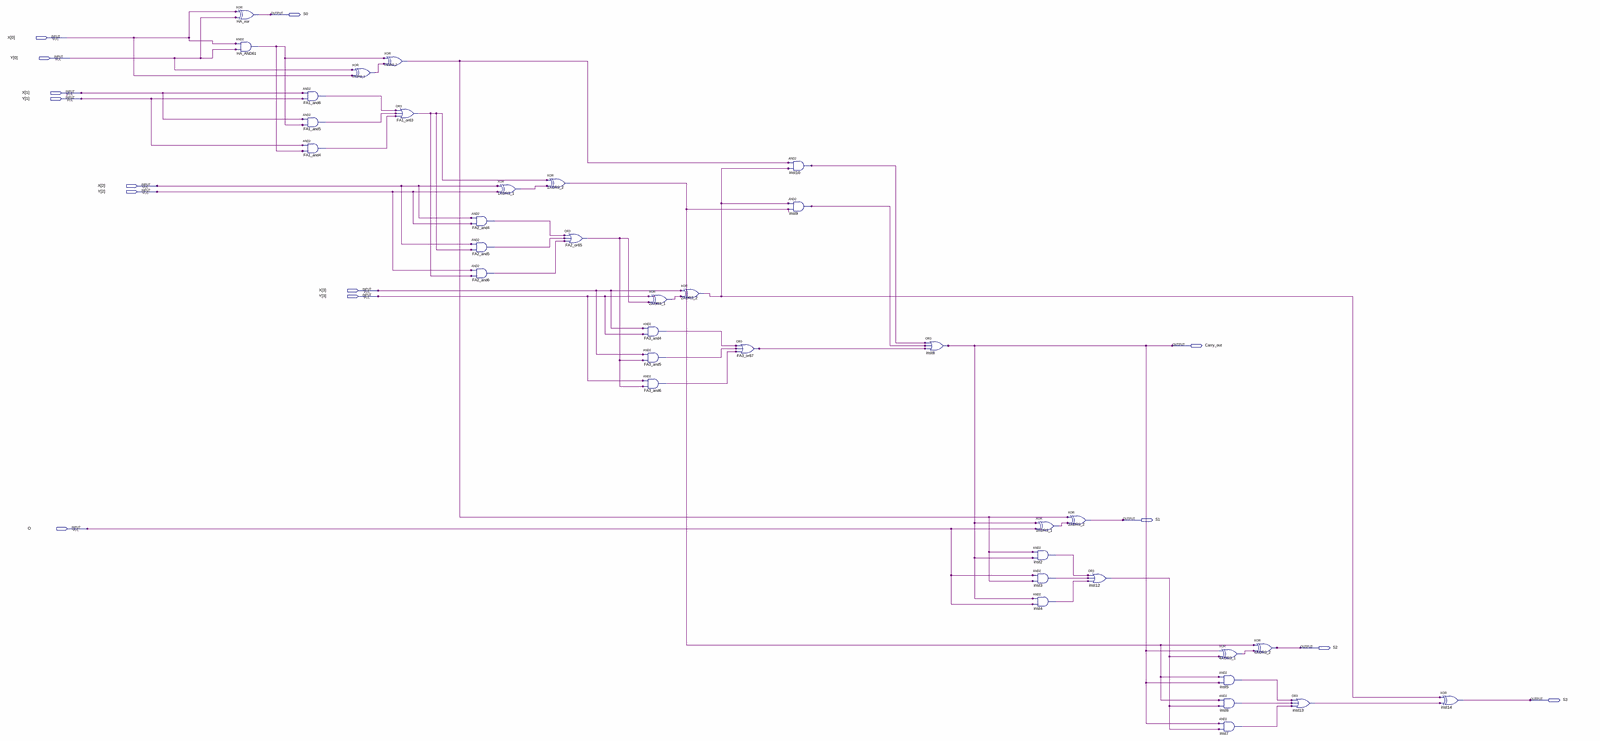
[diagram p0: schematic sheet, whole]
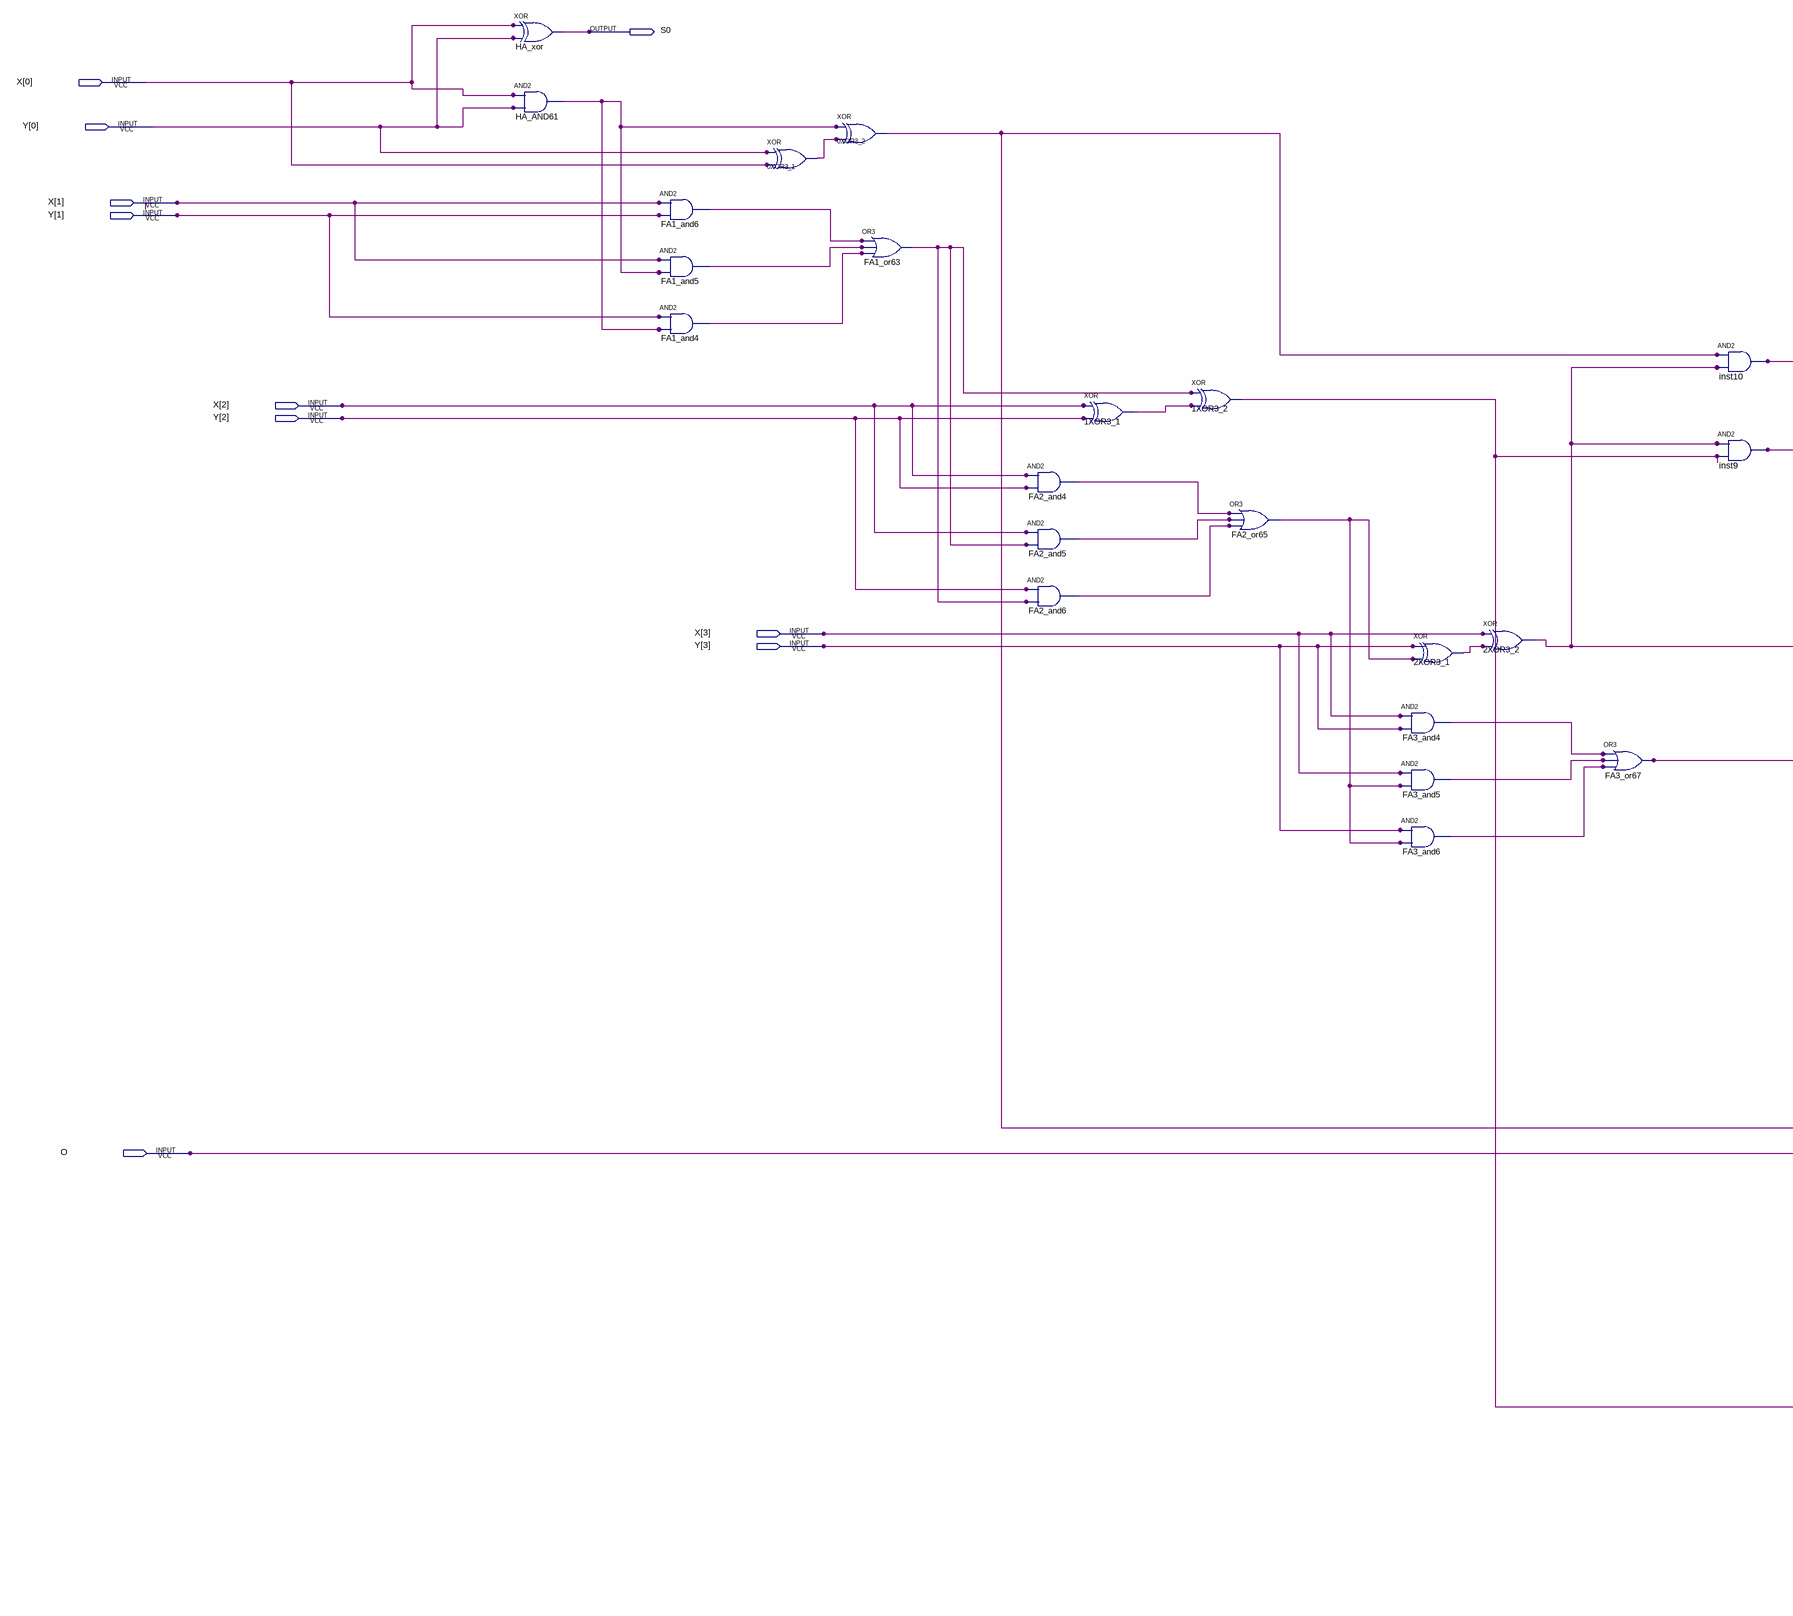
[diagram p1: schematic sheet, left part]
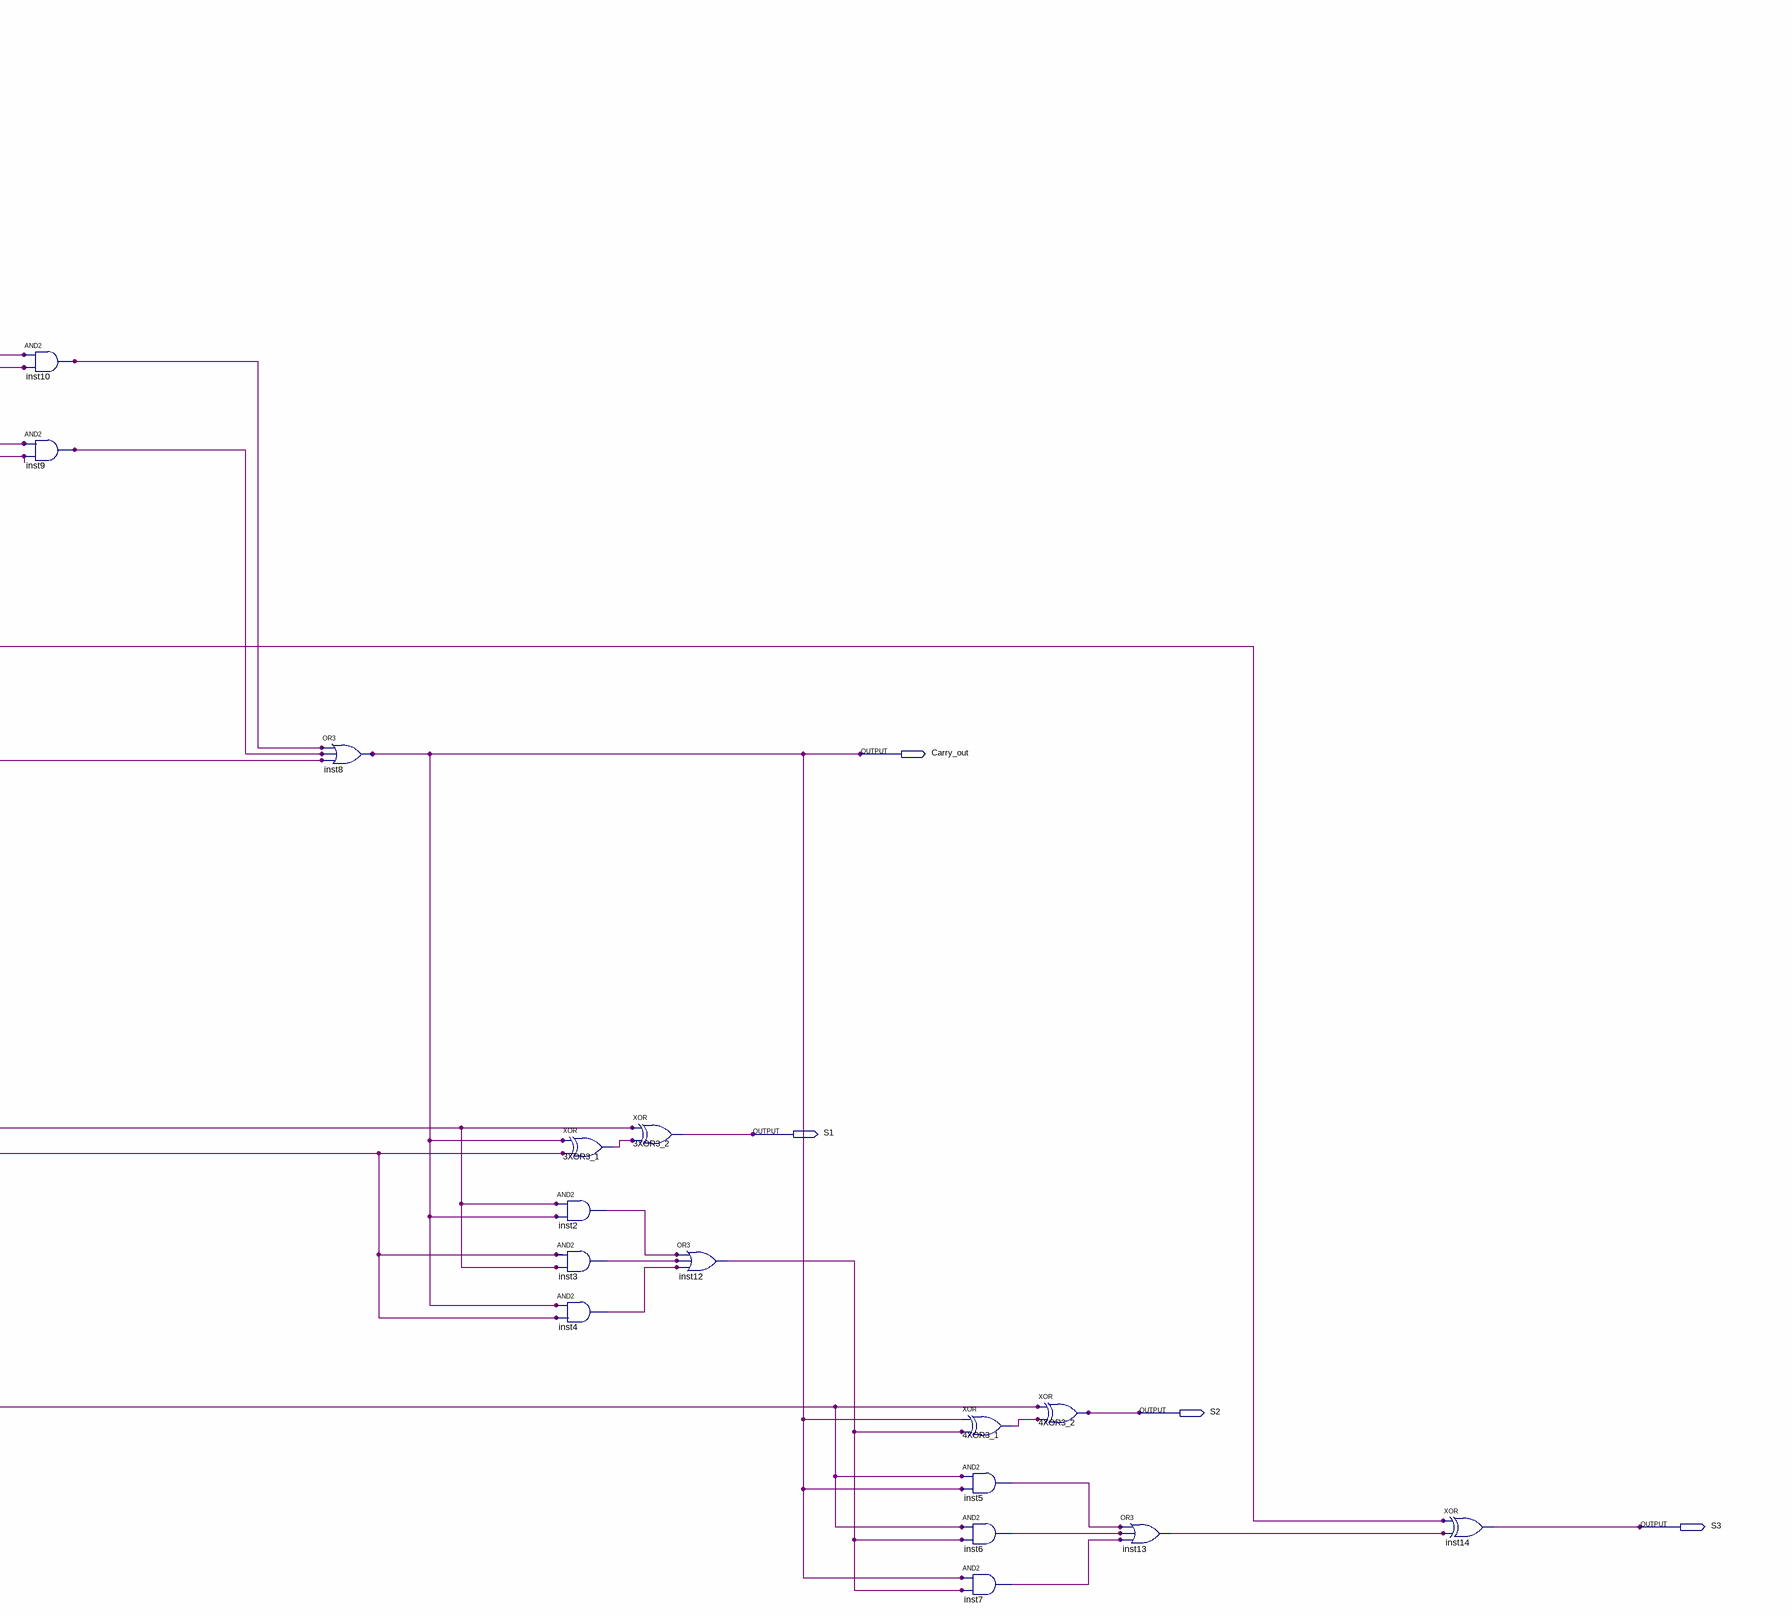
[diagram p2: schematic sheet, right part]
// Quartus schematic Yongru_Pan_VHDL3_BCD.bdf as structural Verilog: 36 symbols, 14 pins
module Yongru_Pan_VHDL3_BCD (
  input  [3:0] X,
  input  [3:0] Y,
  input  O,
  output S0,
  output Carry_out,
  output S1,
  output S2,
  output S3
);

  wire FA1_and4_out, FA1_and5_out, FA1_and6_out, FA1_or63_out, FA2_and4_out, FA2_and5_out, FA2_and6_out,
       FA2_or65_out, FA3_and4_out, FA3_and5_out, FA3_and6_out, FA3_or67_out, HA_AND61_out, inst2_out,
       inst3_out, inst4_out, inst5_out, inst6_out, inst7_out, inst9_out, inst10_out, inst12_out, inst13_out,
       n0XOR3_1_out, n0XOR3_2_out, n1XOR3_1_out, n1XOR3_2_out, n2XOR3_1_out, n2XOR3_2_out, n3XOR3_1_out,
       n4XOR3_1_out;

  xor HA_xor (S0, X[0], Y[0]);
  and HA_AND61 (HA_AND61_out, X[0], Y[0]);
  and FA1_and6 (FA1_and6_out, X[1], Y[1]);
  and FA1_and5 (FA1_and5_out, X[1], HA_AND61_out);
  and FA1_and4 (FA1_and4_out, Y[1], HA_AND61_out);
  xor u_0XOR3_1 (n0XOR3_1_out, Y[0], X[0]);
  xor u_0XOR3_2 (n0XOR3_2_out, HA_AND61_out, n0XOR3_1_out);
  or FA1_or63 (FA1_or63_out, FA1_and6_out, FA1_and5_out, FA1_and4_out);
  and FA2_and4 (FA2_and4_out, X[2], Y[2]);
  and FA2_and5 (FA2_and5_out, X[2], FA1_or63_out);
  and FA2_and6 (FA2_and6_out, Y[2], FA1_or63_out);
  xor u_1XOR3_1 (n1XOR3_1_out, X[2], Y[2]);
  xor u_1XOR3_2 (n1XOR3_2_out, FA1_or63_out, n1XOR3_1_out);
  or FA2_or65 (FA2_or65_out, FA2_and4_out, FA2_and5_out, FA2_and6_out);
  and FA3_and4 (FA3_and4_out, X[3], Y[3]);
  and FA3_and5 (FA3_and5_out, X[3], FA2_or65_out);
  and FA3_and6 (FA3_and6_out, Y[3], FA2_or65_out);
  xor u_2XOR3_1 (n2XOR3_1_out, Y[3], FA2_or65_out);
  xor u_2XOR3_2 (n2XOR3_2_out, X[3], n2XOR3_1_out);
  or FA3_or67 (FA3_or67_out, FA3_and4_out, FA3_and5_out, FA3_and6_out);
  and inst10 (inst10_out, n0XOR3_2_out, n2XOR3_2_out);
  and inst9 (inst9_out, n2XOR3_2_out, n1XOR3_2_out);
  or inst8 (Carry_out, inst10_out, inst9_out, FA3_or67_out);
  xor u_3XOR3_1 (n3XOR3_1_out, Carry_out, O);
  and inst2 (inst2_out, n0XOR3_2_out, Carry_out);
  and inst3 (inst3_out, O, n0XOR3_2_out);
  and inst4 (inst4_out, Carry_out, O);
  xor u_3XOR3_2 (S1, n0XOR3_2_out, n3XOR3_1_out);
  or inst12 (inst12_out, inst2_out, inst3_out, inst4_out);
  xor u_4XOR3_1 (n4XOR3_1_out, Carry_out, inst12_out);
  and inst5 (inst5_out, n1XOR3_2_out, Carry_out);
  and inst6 (inst6_out, n1XOR3_2_out, inst12_out);
  and inst7 (inst7_out, Carry_out, inst12_out);
  xor u_4XOR3_2 (S2, n1XOR3_2_out, n4XOR3_1_out);
  or inst13 (inst13_out, inst5_out, inst6_out, inst7_out);
  xor inst14 (S3, n2XOR3_2_out, inst13_out);
endmodule
